# Altium schematic sheet 10_SES.SchDoc
size A3
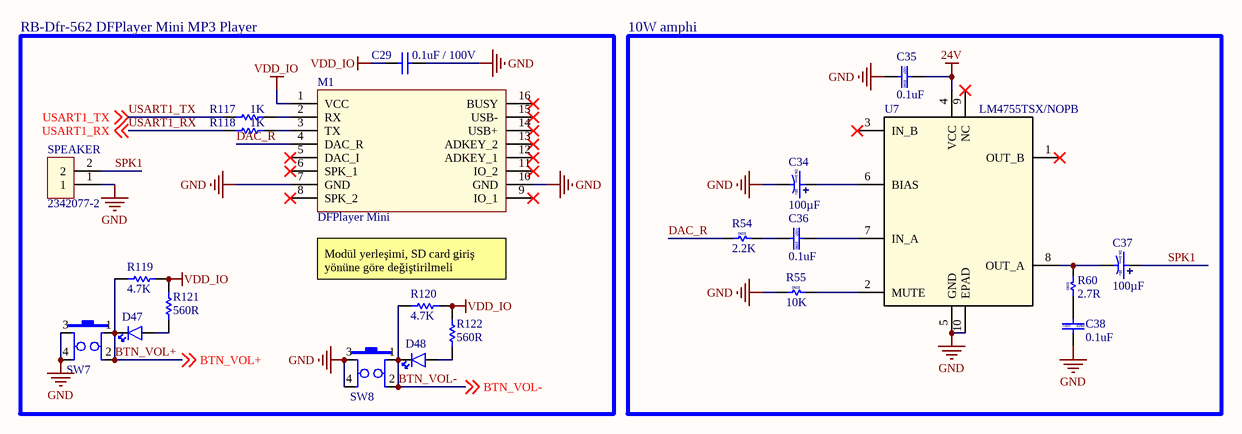
[diagram p0: 10_SES.SchDoc]

## Parts
C29  0.1uF / 100V  [603C]
C34  100µF  [CAPALP_6.6x6.6mm]
C35  0.1uF  [603C]
C36  0.1uF  [603C]
C37  100µF  [CAPALP_6.6x6.6mm]
C38  0.1uF  [603C]
D47  led_green  [805LED]  (value not drawn)
D48  led_green  [805LED]  (value not drawn)
M1  DFPlayer Mini  [DFPLAYER MINI]
R54  2.2K  [603R]
R55  10K  [603R]
R60  2.7R  [603R]
R117  1K  [603R]
R118  1K  [603R]
R119  4.7K  [603R]
R120  4.7K  [603R]
R121  560R  [603R]
R122  560R  [603R]
SPEAKER  2342077-2  [TERM BLOCK HDR 2POS 90DEG PITCH 3.81MM]
SW7  switch tactile  [SW_TACTILE_6X6mm SMT]  (value not drawn)
SW8  switch tactile  [SW_TACTILE_6X6mm SMT]  (value not drawn)
U7  LM4755TSX/NOPB  [TO-263-10 (9 Leads + Tab)]

## Blocks framed on the sheet
RB-Dfr-562 DFPlayer Mini MP3 Player: C29 D47 D48 M1 R117-R122 SPEAKER SW7 SW8
10W amphi: C34-C38 R54 R55 R60 U7

## Nets
24V: C35.2 U7.4(VCC)
GND: C29.2 C34.2 C35.1 C38.1 M1.7(GND) M1.10(GND) R55.1 SPEAKER.1 SW7.3 SW7.4 SW8.3 SW8.4 U7.5(GND) U7.10(EPAD)
VDD_IO: C29.1 M1.1(VCC) R119.2 R120.2 R121.2 R122.2
BTN_VOL+: D47.2(K) R119.1 SW7.1 SW7.2 ; off-sheet BTN_VOL+
BTN_VOL-: D48.2(K) R120.1 SW8.1 SW8.2 ; off-sheet BTN_VOL-
DAC_R: M1.4(DAC_R) R54.1
SPK1: C37.1 SPEAKER.2
USART1_RX: R118.1 ; off-sheet USART1_RX
USART1_TX: R117.1 ; off-sheet USART1_TX
NetC34_1: C34.1 U7.6(BIAS)
NetC36_1: C36.1 R54.2
NetC36_2: C36.2 U7.7(IN_A)
NetC37_2: C37.2 R60.2 U7.8(OUT_A)
NetC38_2: C38.2 R60.1
NetD47_1: D47.1(A) R121.1
NetD48_1: D48.1(A) R122.1
NetM1_2: M1.2(RX) R117.2
NetM1_3: M1.3(TX) R118.2
NetR55_2: R55.2 U7.2(MUTE)

Not connected (* = marked no-connect by the designer): M1 5(DAC_I)* 6(SPK_1)* 8(SPK_2)* 9(IO_1)* 11(IO_2)* 12(ADKEY_1)* 13(ADKEY_2)* 14(USB+)* 15(USB-)* 16(BUSY)*; U7 1(OUT_B)* 3(IN_B)* 9(NC)*

## Notes on the sheet
- Modül yerleşimi, SD card giriş yönüne göre değiştirilmeli
- (in symbol CAP CER 0.1UF 100V X7R 0603) 0603
- (in symbol CAP_ALP_100uF_35V_%20_DIA6.3mm) D6.3mm
- (in symbol RES 2.2K OHM 5% 1/10W 0603) 0603
- (in symbol RES 2.7 OHM 1% 1/10W 0603) 0603
- (in symbol RES_10K_OHM_%5_0.1W_0603) 0603

## Library data of the parts
C29 C35 C36 C38 = CAP CER 0.1UF 100V X7R 0603: 0.1 µF ±10% 100V Ceramic Capacitor X7R 0603 (1608 Metric); Manufacturer: Venkel; Manufacturer Part Number: C0603X7R101-104KNP; Digi-Key Part Number: 2679-C0603X7R101-104KNPTR-ND; Tolerance: ±10%; Voltage - Rated: 100V; Temperature Coefficient: X7R; Operating Temperature: -55°C ~ 125°C; Applications: General Purpose; Package / Case: 0603 (1608 Metric)
  C29: Value: 0.1uF / 100V
  C35 C36 C38: Value: 0.1uF
C34 C37 = CAP_ALP_100uF_35V_%20_DIA6.3mm: 100µF 35V Aluminum Electrolytic Capacitors Radial, Can - SMD 1000 Hrs @ 105°C; Manufacturer: Nichicon; Manufacturer Part Number: UWT1V101MCL1GS; Ripple Current: 84mA @ 120Hz / 126mA @ 10kHz; Surface Mount Land Size: 0.260" L x 0.260" W (6.60mm x 6.60mm); Tolerance: ±20%; value: 100µF; Digi-Key Part Number: 493-2203-2-ND; Package / Case: Radial, Can - SMD (R 6.6mm); ESR (Equivalent Series Resistance): -; Operating Temperature: -55°C ~ 105°C; Voltage - Rated: 35V; Size / Dimension: 0.248" Dia (6.30mm); Height - Seated (Max): 0.303" (7.70mm)
D47 D48 = LED_GREEN_0805: LED 2X1.2MM 570NM GN WTR CLR SMD; Millicandela Rating: 50mcd; Voltage - Forward (Vf): 2.1V; value: led_green; Digi-Key Part Number: 754-1127-1-ND; Case: 0805; Viewing Angle: -
M1 = MP3 PLAYER MODULE DFPlayer Mini: DFPLayer Mini module is a serial MP3 module provides the perfect integrated MP3, WMV hardware decoding.; Value: DFPlayer Mini
R54 = RES 2.2K OHM 5% 1/10W 0603: 2.2 kOhms ±5% 0.1W, 1/10W Chip Resistor 0603 (1608 Metric) Automotive AEC-Q200 Thick Film; Temperature Coefficient: ±200ppm/°C; Value: 2.2K; Digi-Key Part Number: RMCF0603JT2K20TR-ND; Tolerance: ±5%; Power (Watts): 0.1W, 1/10W; Operating Temperature: -55°C ~ 155°C; Package / Case: 0603 (1608 Metric)
R55 = RES_10K_OHM_%5_0.1W_0603: 10 kOhms ±5% 0.1W, 1/10W Chip Resistor 0603 (1608 Metric) Moisture Resistant Thick Film; Manufacturer: Yageo; Manufacturer Part Number: RC0603JR-0710KL; Temperature Coefficient: ±100ppm/°C; Value: 10K; Digi-Key Part Number: 311-10KGRTR-ND; Tolerance: ±5%; Power (Watts): 0.1W, 1/10W; Composition: Thick Film; Operating Temperature: -55°C ~ 155°C; Package / Case: 0603 (1608 Metric); Size / Dimension: 0.063" L x 0.032" W (1.60mm x 0.80mm); Height - Seated (Max): 0.022" (0.55mm); Features: Moisture Resistant
R60 = RES 2.7 OHM 1% 1/10W 0603: 2.7 Ohms ±1% 0.1W, 1/10W Chip Resistor 0603 (1608 Metric) Automotive AEC-Q200 Thick Film; Manufacturer: Stackpole Electronics Inc; Manufacturer Part Number: RMCF0603FT2R70; Temperature Coefficient: ±200ppm/°C; Value: 2.7R; Digi-Key Part Number: RMCF0603FT2R70CT-ND; Tolerance: ±1%; Power (Watts): 0.1W, 1/10W; Composition: Thick Film; Operating Temperature: -55°C ~ 155°C; Package / Case: 0603 (1608 Metric); Size / Dimension: 0.063" L x 0.032" W (1.60mm x 0.80mm); Height - Seated (Max): 0.022" (0.55mm); Features: Automotive AEC-Q200
R117 R118 = RES_1K_OHM_%5_0.1W_0603: 1 kOhms ±5% 0.1W, 1/10W Chip Resistor 0603 (1608 Metric) Moisture Resistant Thick Film; Manufacturer: Yageo; Manufacturer Part Number: RC0603JR-071KL; Temperature Coefficient: ±100ppm/°C; Value: 1K; Digi-Key Part Number: 311-1.0KGRTR-ND; Tolerance: ±5%; Power (Watts): 0.1W, 1/10W; Composition: Thick Film; Operating Temperature: -55°C ~ 155°C; Package / Case: 0603 (1608 Metric); Size / Dimension: 0.063" L x 0.032" W (1.60mm x 0.80mm); Height - Seated (Max): 0.022" (0.55mm); Features: Moisture Resistant
R119 R120 = RES_4.7K_OHM_%5_0.1W_0603: 4.7 kOhms ±5% 0.1W, 1/10W Chip Resistor 0603 (1608 Metric) Moisture Resistant Thick Film; Manufacturer: Yageo; Manufacturer Part Number: RC0603JR-074K7L; Temperature Coefficient: ±100ppm/°C; Value: 4.7K; Digi-Key Part Number: 311-4.7KGRTR-ND; Tolerance: ±5%; Power (Watts): 0.1W, 1/10W; Composition: Thick Film; Operating Temperature: -55°C ~ 155°C; Package / Case: 0603 (1608 Metric); Size / Dimension: 0.063" L x 0.032" W (1.60mm x 0.80mm); Height - Seated (Max): 0.022" (0.55mm); Features: Moisture Resistant
R121 R122 = RES_560_OHM_%5_0.1W_0603: 560 Ohms ±5% 0.1W, 1/10W Chip Resistor 0603 (1608 Metric) Moisture Resistant Thick Film; Manufacturer: Yageo; Manufacturer Part Number: RC0603JR-07560RL; Temperature Coefficient: ±100ppm/°C; Value: 560R; Digi-Key Part Number: 311-560GRCT-ND; Tolerance: ±5%; Power (Watts): 0.1W, 1/10W; Composition: Thick Film; Operating Temperature: -55°C ~ 155°C; Package / Case: 0603 (1608 Metric); Size / Dimension: 0.063" L x 0.032" W (1.60mm x 0.80mm); Height - Seated (Max): 0.022" (0.55mm); Features: Moisture Resistant
SPEAKER = TERM BLOCK HDR 2POS 90DEG 3.81MM: 2 Position Terminal Block Header, Male Pins, Shrouded (4 Side) 0.150" (3.81mm) 90°, Right Angle - Through Hole; Manufacturer: TE Connectivity AMP Connectors; Contact Tail Length: 0.075" (1.90mm); Digi-Key Part Number: A145321-ND; Value: 2342077-2; Pitch: 0.150" (3.81mm); Header Orientation: 90°, Right Angle; Insulation Height: 0.285" (7.25mm)
SW7 SW8 = SW_TACTILE_6x6x4.3mm SMT: Tactile Switch SPST-NO Top Actuated Surface Mount; Switch Function: Off-Mom; Value: switch tactile; Digi-Key Part Number: CKN9112TR-ND; case: 6.00mm x 6.00mm_H4.30mm
U7 = IC AMP CLASS AB STER 11W TO263-9 LM4755TSXNOPB: Amplifier IC 2-Channel (Stereo) Class AB DDPAK/TO-263-9; Manufacturer: Texas Instruments; Voltage - Supply: 9V ~ 32V; Max Output Power x Channels @ Load: 11W x 2 @ 4Ohm; Package / Case: TO-263-10 (9 Leads + Tab); Operating Temperature: -20°C ~ 80°C; Features: Mute, Short-Circuit and Thermal Protection; Output Type: 2-Channel (Stereo); Type: Class AB; Value: LM4755TSX/NOPB; DigiKey Part Number: 296-46304-1-ND